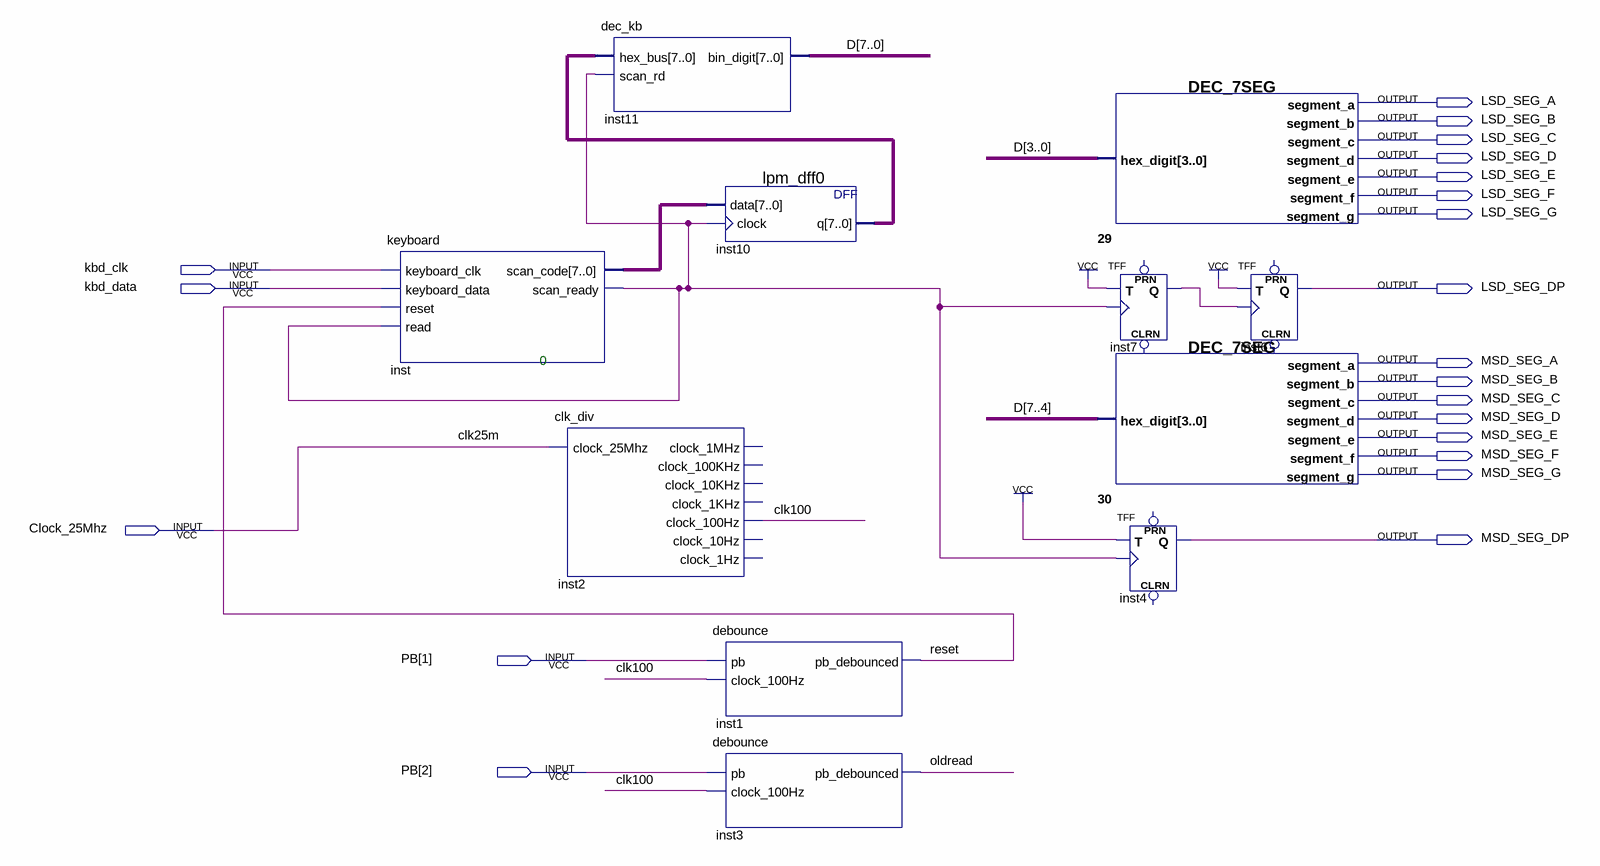
[diagram p0: schematic sheet]
// Quartus schematic ap3.bdf as structural Verilog: 11 symbols, 21 pins
module ap3 (
  input  kbd_clk,
  input  kbd_data,
  input  Clock_25Mhz,
  input  [2:1] PB,
  output LSD_SEG_A,
  output LSD_SEG_B,
  output LSD_SEG_C,
  output LSD_SEG_D,
  output LSD_SEG_E,
  output LSD_SEG_F,
  output LSD_SEG_G,
  output LSD_SEG_DP,
  output MSD_SEG_A,
  output MSD_SEG_B,
  output MSD_SEG_C,
  output MSD_SEG_D,
  output MSD_SEG_E,
  output MSD_SEG_F,
  output MSD_SEG_G,
  output MSD_SEG_DP
);

  wire clk100, inst7_q, inst_scan_ready, oldread, reset;
  wire [7:0] D, inst10_q, inst_scan_code;

  keyboard inst (
    .keyboard_clk(kbd_clk), .keyboard_data(kbd_data), .reset(reset), .read(inst_scan_ready),
    .scan_code(inst_scan_code), .scan_ready(inst_scan_ready));
  clk_div inst2 (
    .clock_25Mhz(Clock_25Mhz), .clock_100Hz(clk100));  // open: clock_1MHz, clock_100KHz, clock_10KHz, clock_1KHz, clock_10Hz, clock_1Hz
  dec_kb inst11 (.hex_bus(inst10_q), .scan_rd(inst_scan_ready), .bin_digit(D));
  lpm_dff0 inst10 (.data(inst_scan_code), .clock(inst_scan_ready), .q(inst10_q));
  debounce inst1 (.pb(PB[1]), .clock_100Hz(clk100), .pb_debounced(reset));
  debounce inst3 (.pb(PB[2]), .clock_100Hz(clk100), .pb_debounced(oldread));
  DEC_7SEG u_29 (
    .hex_digit(D[3:0]), .segment_a(LSD_SEG_A), .segment_b(LSD_SEG_B), .segment_c(LSD_SEG_C),
    .segment_d(LSD_SEG_D), .segment_e(LSD_SEG_E), .segment_f(LSD_SEG_F), .segment_g(LSD_SEG_G));
  TFF inst7 (.T(1'b1), .CLK(inst_scan_ready), .Q(inst7_q));  // open: PRN, CLRN
  DEC_7SEG u_30 (
    .hex_digit(D[7:4]), .segment_a(MSD_SEG_A), .segment_b(MSD_SEG_B), .segment_c(MSD_SEG_C),
    .segment_d(MSD_SEG_D), .segment_e(MSD_SEG_E), .segment_f(MSD_SEG_F), .segment_g(MSD_SEG_G));
  TFF inst4 (.T(1'b1), .CLK(inst_scan_ready), .Q(MSD_SEG_DP));  // open: PRN, CLRN
  TFF inst6 (.T(1'b1), .CLK(inst7_q), .Q(LSD_SEG_DP));  // open: PRN, CLRN

  // Other names for the same wires on the sheet: clk25m = Clock_25Mhz

  // Notes on the sheet:
  //   0
endmodule
